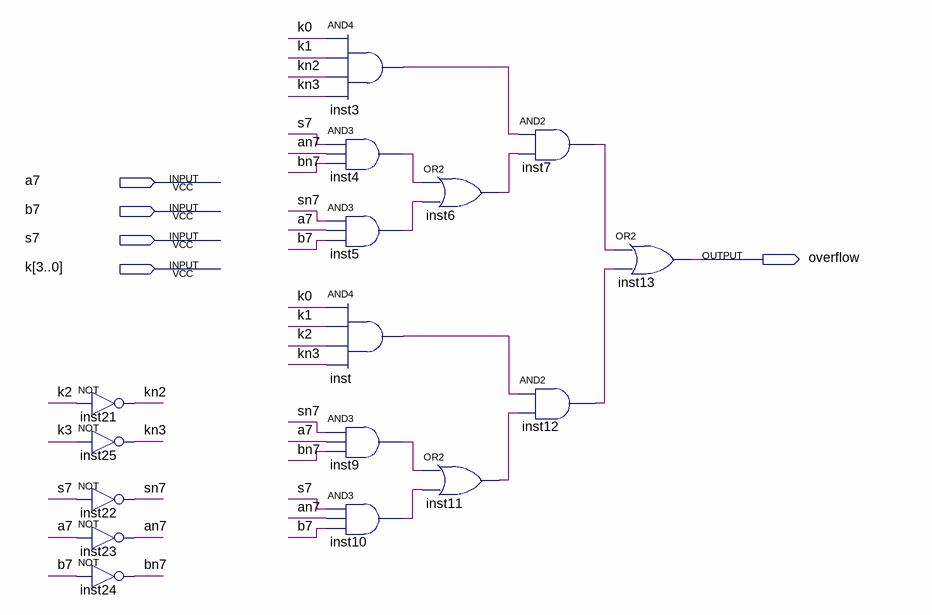
[diagram p0: schematic sheet]
// Quartus schematic overflow_check_ahmes.bdf as structural Verilog: 16 symbols, 5 pins
module overflow_check_ahmes (
  input  a7,
  input  b7,
  input  s7,
  input  [3:0] k,
  output overflow
);

  wire an7, bn7, inst3_out, inst4_out, inst5_out, inst6_out, inst7_out, inst9_out, inst10_out, inst11_out,
       inst12_out, inst_out, kn2, kn3, sn7;

  not inst21 (kn2, k[2]);
  not inst25 (kn3, k[3]);
  not inst22 (sn7, s7);
  not inst23 (an7, a7);
  not inst24 (bn7, b7);
  and inst3 (inst3_out, k[0], k[1], kn2, kn3);
  and inst4 (inst4_out, s7, an7, bn7);
  and inst5 (inst5_out, sn7, a7, b7);
  and inst (inst_out, k[0], k[1], k[2], kn3);
  and inst9 (inst9_out, sn7, a7, bn7);
  and inst10 (inst10_out, s7, an7, b7);
  or inst6 (inst6_out, inst4_out, inst5_out);
  or inst11 (inst11_out, inst9_out, inst10_out);
  and inst7 (inst7_out, inst3_out, inst6_out);
  and inst12 (inst12_out, inst_out, inst11_out);
  or inst13 (overflow, inst7_out, inst12_out);
endmodule
